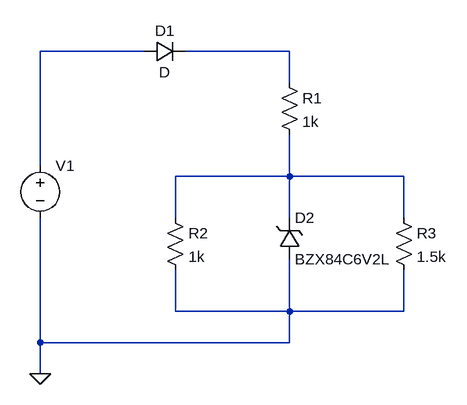
[diagram p0: schematic Experiment 2.asc]
Experiment 2.asc, the LTspice schematic file:
Version 4
SHEET 1 880 680
WIRE 160 0 0 0
WIRE 384 0 224 0
WIRE 384 48 384 0
WIRE 0 176 0 0
WIRE 384 192 384 128
WIRE 384 192 208 192
WIRE 560 192 384 192
WIRE 208 256 208 192
WIRE 384 256 384 192
WIRE 560 256 560 192
WIRE 208 400 208 336
WIRE 384 400 384 320
WIRE 384 400 208 400
WIRE 560 400 560 336
WIRE 560 400 384 400
WIRE 0 448 0 256
WIRE 384 448 384 400
WIRE 384 448 0 448
WIRE 0 496 0 448
FLAG 0 496 0
SYMBOL voltage 0 160 R0
WINDOW 123 0 0 Left 0
WINDOW 39 0 0 Left 0
SYMATTR InstName V1
SYMATTR Value ""
SYMBOL diode 160 16 R270
WINDOW 0 32 32 VTop 2
WINDOW 3 0 32 VBottom 2
SYMATTR InstName D1
SYMBOL res 368 32 R0
SYMATTR InstName R1
SYMATTR Value 1k
SYMBOL res 192 240 R0
SYMATTR InstName R2
SYMATTR Value 1k
SYMBOL res 544 240 R0
SYMATTR InstName R3
SYMATTR Value 1.5k
SYMBOL zener 368 320 M180
WINDOW 0 24 64 Left 2
WINDOW 3 24 0 Left 2
SYMATTR InstName D2
SYMATTR Value BZX84C6V2L
SYMATTR Description Diode
SYMATTR Type diode

The netlist it stands for:
* Experiment 2.asc
V1 N001 0
D1 N001 N002 D
R1 N002 N003 1k
R2 N003 0 1k
R3 N003 0 1.5k
D2 0 N003 BZX84C6V2L
.model D D
.lib standard.dio
.backanno
.end